# Altium schematic sheet Led_rgb.SchDoc
size A4; SheetNumber: 6
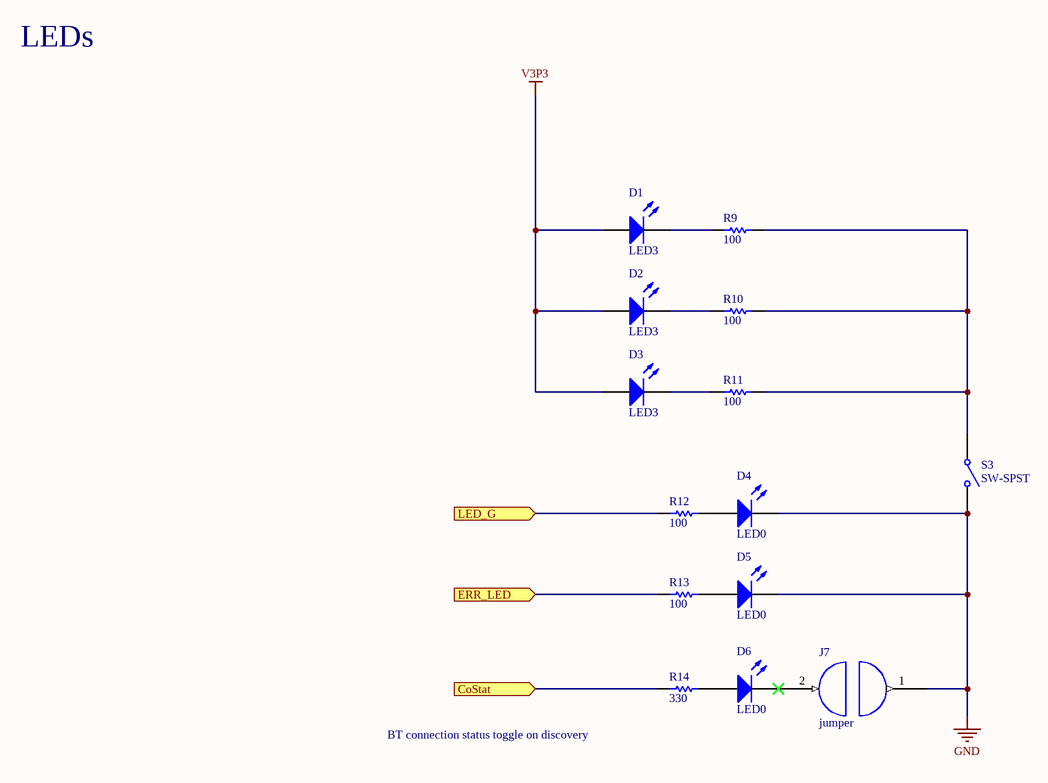
[diagram p0: Led_rgb.SchDoc]

## Parts
D1  LED3  [1608 led]
D2  LED3  [1608 led]
D3  LED3  [1608 led]
D4  LED0  [1608 led]
D5  LED0  [20125 led]
D6  LED0  [1608 led]
J7  jumper  [jumper 254]
R9  100  [own_0603]
R10  100  [own_0603]
R11  100  [own_0603]
R12  100  [own_0603]
R13  100  [own_0603]
R14  330  [own_0603]
S3  SW-SPST  [SPST-2]

## Ports
CoStat (in), ERR_LED (in), LED_G (in)

## Nets
GND: D4.2(K) D5.2(K) J7.1 S3.2(NO)
V3P3: D1.1(A) D2.1(A) D3.1(A)
CoStat: R14.2 ; port CoStat
ERR_LED: R13.1 ; port ERR_LED
LED_G: R12.1 ; port LED_G
NetD1_2: D1.2(K) R9.1
NetD2_2: D2.2(K) R10.1
NetD3_2: D3.2(K) R11.1
NetD4_1: D4.1(A) R12.2
NetD5_1: D5.1(A) R13.2
NetD6_1: D6.1(A) R14.1
NetD6_2: D6.2(K) J7.2
NetR9_2: R9.2 R10.2 R11.2 S3.1(COMMON)

## Notes on the sheet
- LEDs
- BT connection status toggle on discovery

## Library data of the parts
D1-D3 = LED3: Typical BLUE SiC LED; Fabricant: ROHM; RefFabricant: SMLE13WBC8W1; Fournisseur: Farnell; RefFournisseur: 2762565
D4 = LED0: Typical INFRARED GaAs LED; Fabricant: KINGBRIGHT; Fournisseur: Farnell; RefFabricant: KPH-1608SGC; RefFournisseur: 2426215
D5 = LED0: Typical INFRARED GaAs LED; RefFabricant: KP-2012EC; Fournisseur: Farnell; Fabricant: KINGBRIGHT; RefFournisseur: 8529949
D6 = LED0: Typical INFRARED GaAs LED; Fournisseur: Farnell; Fabricant: KINGBRIGHT; RefFabricant: KPT-1608LVVBC-D; RefFournisseur: 2610410
R9-R13 = Res1: Resistor; Value: 1K; Fabricant: VISHAY; Fournisseur: Farnell; RefFabricant: CRCW0603100RJNEA; RefFournisseur: 2616742
R14 = Res1: Resistor; Fournisseur: Farnell; Fabricant: PANASONIC ELECTRONIC COMPONENTS; RefFabricant: ERJ3GEYJ331V; RefFournisseur: 2059588; Value: 330
S3 = SW-SPST: Single-Pole, Single-Throw Switch